# Altium schematic sheet Top.SchDoc
size A4; SheetNumber: 1; SheetTotal: 4
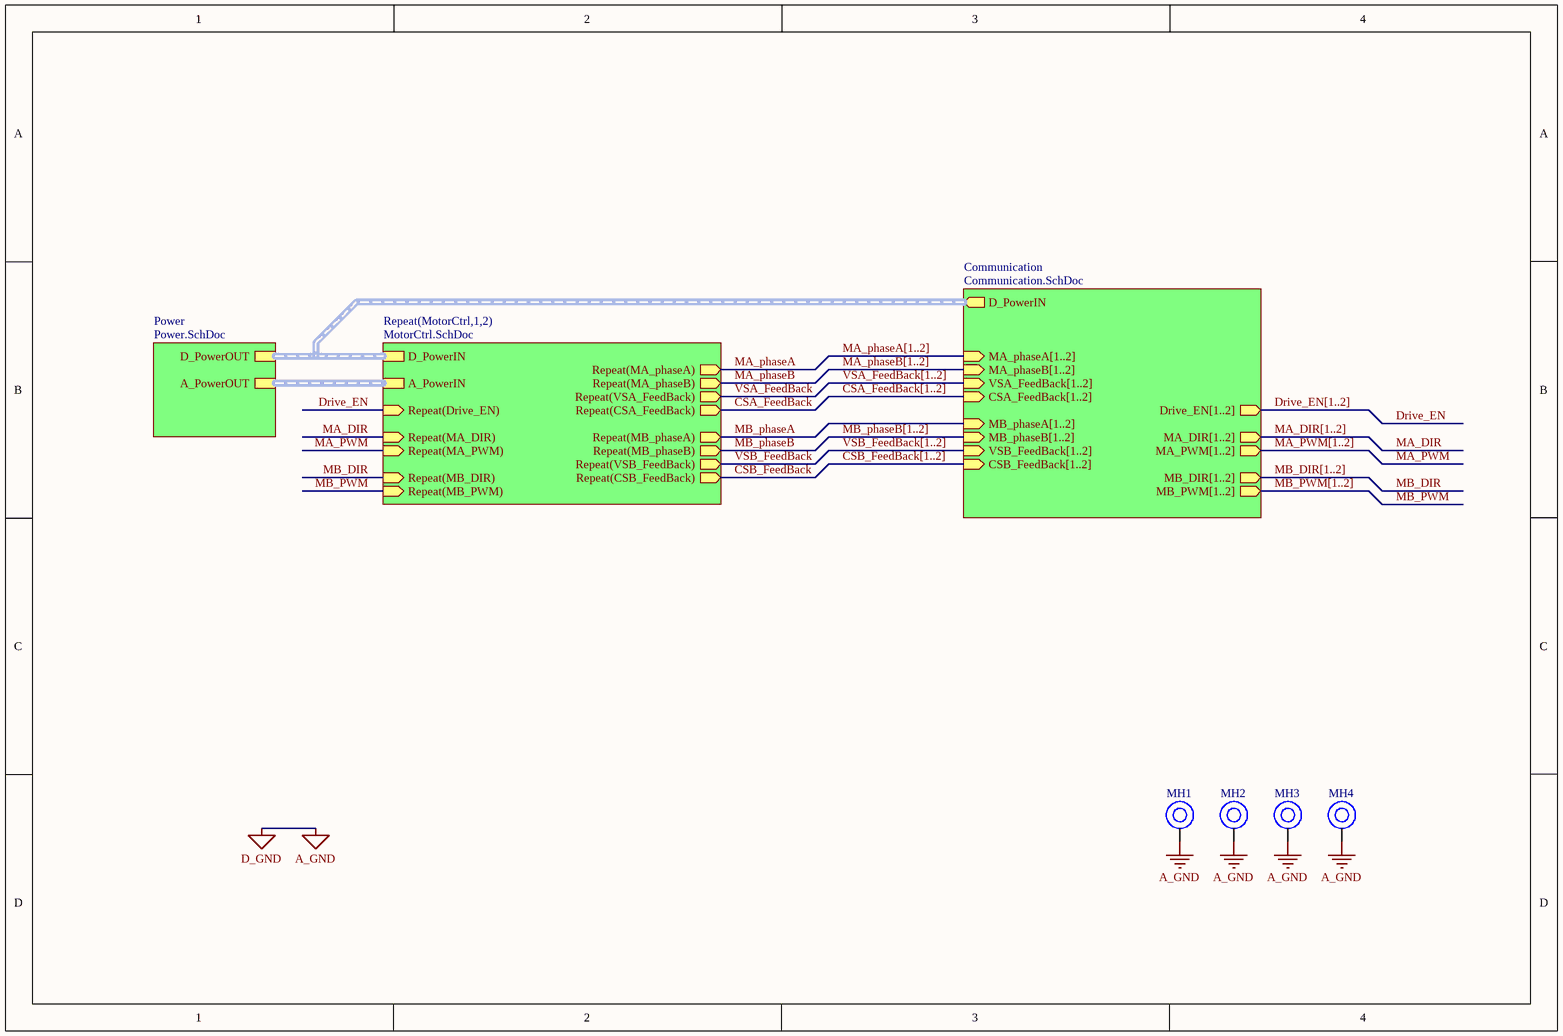
[diagram p0: Top.SchDoc]

## Parts
MH1  M3 Hole  [M3 Hole]  (value not drawn)
MH2  M3 Hole  [M3 Hole]  (value not drawn)
MH3  M3 Hole  [M3 Hole]  (value not drawn)
MH4  M3 Hole  [M3 Hole]  (value not drawn)

## Sub-sheets
Communication = Communication.SchDoc: MA_phaseA[1..2] (in), MA_phaseB[1..2] (in), VSA_FeedBack[1..2] (in), CSA_FeedBack[1..2] (in), MB_phaseA[1..2] (in), MB_phaseB[1..2] (in), VSB_FeedBack[1..2] (in), CSB_FeedBack[1..2] (in), Drive_EN[1..2] (out), MA_DIR[1..2] (out), MB_DIR[1..2] (out), MA_PWM[1..2] (out), MB_PWM[1..2] (out), D_PowerIN (out)
Power = Power.SchDoc: D_PowerOUT, A_PowerOUT
Repeat(MotorCtrl,1,2) = MotorCtrl.SchDoc: D_PowerIN, A_PowerIN, Repeat(MA_DIR) (in), Repeat(MA_PWM) (in), Repeat(MB_DIR) (in), Repeat(MB_PWM) (in), Repeat(Drive_EN) (in), Repeat(MA_phaseA) (out), Repeat(MA_phaseB) (out), Repeat(MB_phaseA) (out), Repeat(MB_phaseB) (out), Repeat(VSA_FeedBack) (out), Repeat(VSB_FeedBack) (out), Repeat(CSA_FeedBack) (out), Repeat(CSB_FeedBack) (out)

## Nets
A_GND: MH1.1 MH2.1 MH3.1 MH4.1  [also labelled D_GND]
CSA_FeedBack: sheet Repeat(MotorCtrl,1,2)/Repeat(CSA_FeedBack)
CSB_FeedBack: sheet Repeat(MotorCtrl,1,2)/Repeat(CSB_FeedBack)
Drive_EN: sheet Repeat(MotorCtrl,1,2)/Repeat(Drive_EN)
MA_DIR: sheet Repeat(MotorCtrl,1,2)/Repeat(MA_DIR)
MA_phaseA: sheet Repeat(MotorCtrl,1,2)/Repeat(MA_phaseA)
MA_phaseB: sheet Repeat(MotorCtrl,1,2)/Repeat(MA_phaseB)
MA_PWM: sheet Repeat(MotorCtrl,1,2)/Repeat(MA_PWM)
MB_DIR: sheet Repeat(MotorCtrl,1,2)/Repeat(MB_DIR)
MB_phaseA: sheet Repeat(MotorCtrl,1,2)/Repeat(MB_phaseA)
MB_phaseB: sheet Repeat(MotorCtrl,1,2)/Repeat(MB_phaseB)
MB_PWM: sheet Repeat(MotorCtrl,1,2)/Repeat(MB_PWM)
VSA_FeedBack: sheet Repeat(MotorCtrl,1,2)/Repeat(VSA_FeedBack)
VSB_FeedBack: sheet Repeat(MotorCtrl,1,2)/Repeat(VSB_FeedBack)

## Buses and harness runs
bus CSA_FeedBack[1..2] = sheet Communication/CSA_FeedBack[1..2]
bus CSB_FeedBack[1..2] = sheet Communication/CSB_FeedBack[1..2]
bus Drive_EN[1..2] = sheet Communication/Drive_EN[1..2]
bus MA_DIR[1..2] = sheet Communication/MA_DIR[1..2]
bus MA_phaseA[1..2] = sheet Communication/MA_phaseA[1..2]
bus MA_phaseB[1..2] = sheet Communication/MA_phaseB[1..2]
bus MA_PWM[1..2] = sheet Communication/MA_PWM[1..2]
bus MB_DIR[1..2] = sheet Communication/MB_DIR[1..2]
bus MB_phaseB[1..2] = sheet Communication/MB_phaseB[1..2]
bus MB_PWM[1..2] = sheet Communication/MB_PWM[1..2]
bus VSA_FeedBack[1..2] = sheet Communication/VSA_FeedBack[1..2]
bus VSB_FeedBack[1..2] = sheet Communication/VSB_FeedBack[1..2]
harness sheet Communication/D_PowerIN = sheet Power/D_PowerOUT = sheet Repeat(MotorCtrl,1,2)/D_PowerIN
harness sheet Power/A_PowerOUT = sheet Repeat(MotorCtrl,1,2)/A_PowerIN

## Library data of the parts
MH1-MH4 = M3_Hole